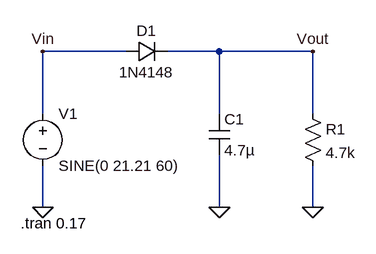
[diagram p0: schematic lab_2-circuito_cap-4_7k.asc]
lab_2-circuito_cap-4_7k.asc, the LTspice schematic file:
Version 4
SHEET 1 880 680
WIRE 192 -32 64 -32
WIRE 336 -32 256 -32
WIRE 480 -32 336 -32
WIRE 64 64 64 -32
WIRE 336 64 336 -32
WIRE 480 64 480 -32
WIRE 64 208 64 144
WIRE 336 208 336 128
WIRE 480 208 480 144
FLAG 64 208 0
FLAG 480 208 0
FLAG 336 208 0
FLAG 64 -32 Vin
FLAG 480 -32 Vout
SYMBOL res 464 48 R0
SYMATTR InstName R1
SYMATTR Value 4.7k
SYMBOL cap 320 64 R0
SYMATTR InstName C1
SYMATTR Value 4.7µ
SYMBOL voltage 64 48 R0
WINDOW 123 0 0 Left 0
WINDOW 39 0 0 Left 0
SYMATTR InstName V1
SYMATTR Value SINE(0 21.21 60)
SYMBOL diode 192 -16 R270
WINDOW 0 32 32 VTop 2
WINDOW 3 0 32 VBottom 2
SYMATTR InstName D1
SYMATTR Value 1N4148
TEXT 30 232 Left 2 !.tran 0.17

The netlist it stands for:
* lab_2-circuito_cap-4_7k.asc
R1 Vout 0 4.7k
C1 Vout 0 4.7µ
V1 Vin 0 SINE(0 21.21 60)
D1 Vin Vout 1N4148
.model D D
.lib standard.dio
.tran 0.17
.backanno
.end

* Results of the author's LTspice run, read from the files saved beside the schematic
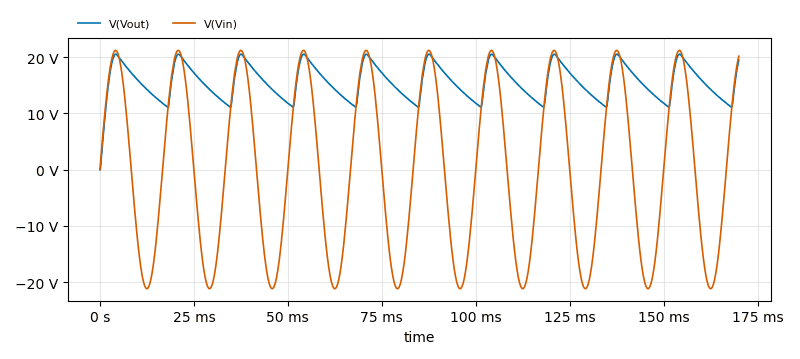
[diagram p1: Transient Analysis of lab_2-circuito_cap-4_7k.asc, plotted from the saved traces]
* Transient Analysis, 1 run:
*   V(Vout): min 0 V, max 20.53 V, average 15.57 V, rms 15.87 V, last 19.45 V
*   V(Vin): min -21.21 V, max 21.21 V, average 227.7 mV, rms 14.96 V, last 20.17 V